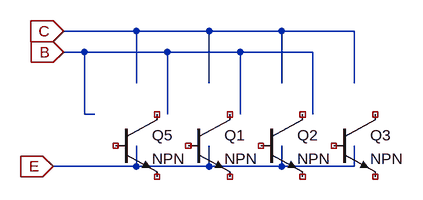
[diagram p0: schematic NPN4.asc]
NPN4.asc, the LTspice schematic file:
Version 4
SHEET 1 880 1556
WIRE -800 16 -912 16
WIRE -688 16 -800 16
WIRE -576 16 -688 16
WIRE -464 16 -576 16
WIRE -880 48 -912 48
WIRE -752 48 -880 48
WIRE -640 48 -752 48
WIRE -528 48 -640 48
WIRE -800 96 -800 16
WIRE -688 96 -688 16
WIRE -576 96 -576 16
WIRE -464 96 -464 16
WIRE -880 144 -880 48
WIRE -864 144 -880 144
WIRE -752 144 -752 48
WIRE -640 144 -640 48
WIRE -528 144 -528 48
WIRE -800 224 -800 192
WIRE -800 224 -928 224
WIRE -688 224 -688 192
WIRE -688 224 -800 224
WIRE -576 224 -576 192
WIRE -576 224 -688 224
WIRE -464 224 -464 192
WIRE -464 224 -576 224
FLAG -912 16 C
IOPIN -912 16 In
FLAG -928 224 E
IOPIN -928 224 In
FLAG -912 48 B
IOPIN -912 48 In
SYMBOL NPN -832 144 R0
SYMATTR InstName Q5
SYMBOL NPN -720 144 R0
SYMATTR InstName Q1
SYMBOL NPN -608 144 R0
SYMATTR InstName Q2
SYMBOL NPN -496 144 R0
SYMATTR InstName Q3

The netlist it stands for:
* NPN4.asc
* Q5: NPN (symbol NPN not certain, pin order unknown); nets seen at it: 0
* Q1: NPN (symbol NPN not certain, pin order unknown); nets seen at it: 0
* Q2: NPN (symbol NPN not certain, pin order unknown); nets seen at it: 0
* Q3: NPN (symbol NPN not certain, pin order unknown); nets seen at it: 0
.backanno
.end